# Altium schematic sheet Current-LoadSwitches 5V0.SchDoc
size A
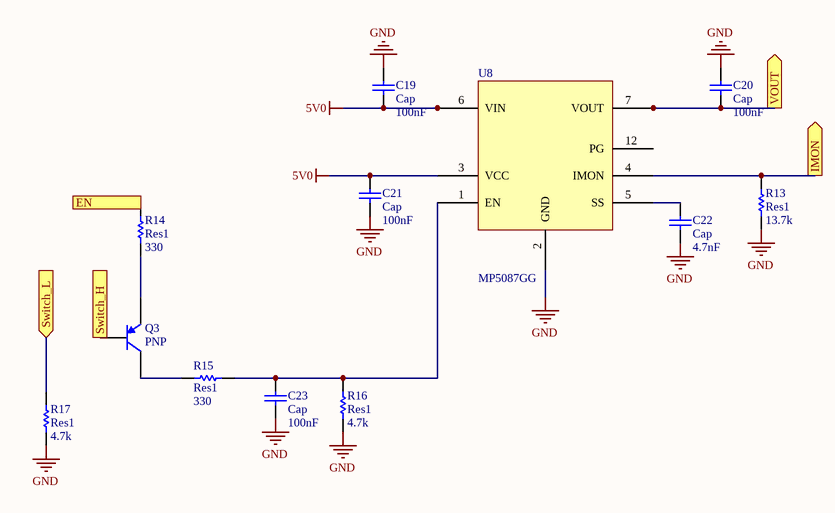
[diagram p0: Current-LoadSwitches 5V0.SchDoc]

## Parts
C19  Cap  value 100nF  [0402-A]
C20  Cap  value 100nF  [0402-A]
C21  Cap  value 100nF  [0402-A]
C22  Cap  value 4.7nF  [0402-A]
C23  Cap  value 100nF  [0402-A]
Q3  PNP  [SOT-23B_N]
R13  Res1  value 13.7k  [0402-A]
R14  Res1  value 330  [0402-A]
R15  Res1  value 330  [0402-A]
R16  Res1  value 4.7k  [0402-A]
R17  Res1  value 4.7k  [0402-A]
U8  MP5087GG  [MP5087GG-Z]

## Ports
EN (in), IMON (out), Switch_H (out), Switch_L (in), VOUT (out)

## Nets
5V0: C19.1 C21.2 U8.3(VCC) U8.6(VIN) U8.11(VOUT)
GND: C19.2 C20.2 C21.1 C22.1 C23.1 R13.1 R16.1 R17.1 U8.2(GND)
EN: R14.2 ; port EN
IMON: R13.2 U8.4(IMON) ; port IMON
Switch_H: Q3.2(B) ; port Switch_H
Switch_L: R17.2 ; port Switch_L
VOUT: C20.1 U8.7(VOUT) U8.8(VOUT) U8.9(VOUT) U8.10(VOUT) ; port VOUT
NetC22_2: C22.2 U8.5(SS)
NetC23_2: C23.2 R15.2 R16.2 U8.1(EN)
NetQ3_1: Q3.1(C) R15.1
NetQ3_3: Q3.3(E) R14.1

Not connected (* = marked no-connect by the designer): U8 12(PG)

## Library data of the parts
C19-C23 = Cap: Capacitor; Published: 8-Jun-2000; LatestRevisionDate: 17-Jul-2002; LatestRevisionNote: Re-released for DXP Platform.; PackageReference: RAD-0.3; Publisher: Altium Limited; PackageDescription: Radial Cap, Thru-Hole; 2 Leads; 0.3 in Pin Spacing
Q3 = PNP: PNP Bipolar Transistor; Published: 8-Jun-2000; LatestRevisionDate: 29-May-2009; LatestRevisionNote: IPC-7351 Footprint Added.; PackageVersion: Aug-1999; PackageReference: SOT-23B; Publisher: Altium Limited; PackageDescription: 3-Pin SOT-23 Package 0.95 mm Pitch, 2.4 mm Lead Span
R13-R17 = Res1: Resistor; Published: 8-Jun-2000; LatestRevisionDate: 17-Jul-2002; LatestRevisionNote: Re-released for DXP Platform.; PackageReference: AXIAL-0.3; Publisher: Altium Limited; PackageDescription: Axial Device, Thru-Hole; 2 Leads; 0.3 in Pin Spacing
U8 = Component_1